# Altium schematic sheet PLD_RadFET_Watchdog.SchDoc: Watchdog for RadFET
size A4
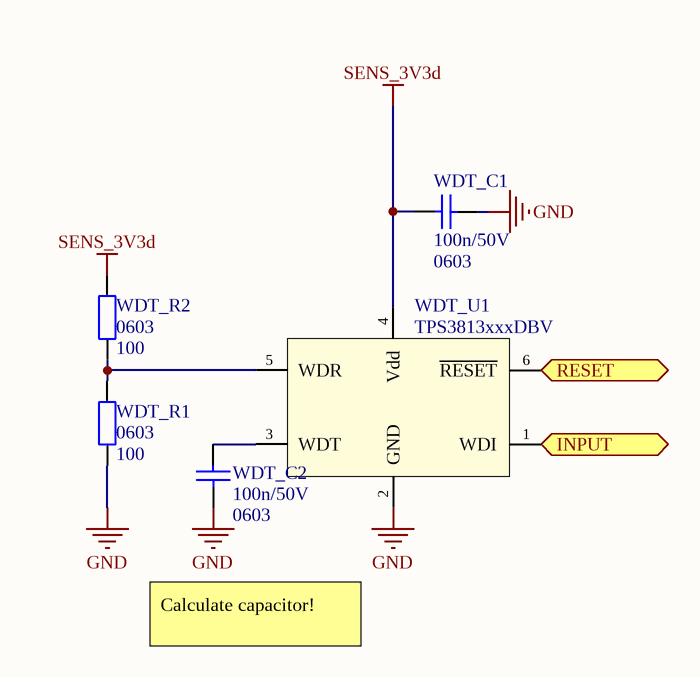
[diagram p0: PLD_RadFET_Watchdog.SchDoc]

## Parts
WDT_C1  Package: 0603  [SMD_Capacitor_0603]  (hidden comment: 100n/50V)
WDT_C2  Package: 0603  [SMD_Capacitor_0603]  (hidden comment: 100n/50V)
WDT_R1  0603  value 100  [SMD_Resistor_0603]
WDT_R2  0603  value 100  [SMD_Resistor_0603]
WDT_U1  TPS3813xxxDBV  [SOT23-6]

## Ports
INPUT (in), RESET (out)

## Nets
GND: WDT_C1.2 WDT_C2.2 WDT_R1.1 WDT_U1.2(GND)
SENS_3V3d: WDT_C1.1 WDT_R2.2 WDT_U1.4(Vdd)
INPUT: WDT_U1.1(WDI) ; port INPUT
RESET: WDT_U1.6(~{RESET}) ; port RESET
NetWDT_C2_1: WDT_C2.1 WDT_U1.3(WDT)
NetWDT_R1_2: WDT_R1.2 WDT_R2.1 WDT_U1.5(WDR)

## Notes on the sheet
- Calculate capacitor!
- Title:
- Project:
- Author:
- Model:
- Document Number:
- Checked by:
- Rev:
- Date:
- Approved by:
- Sheet:
- of
- File name:

## Library data of the parts
WDT_C1 WDT_C2 = Cer_C0603T104K5RALTU: Ceramic Cap Kemet COTS 100n/50V X7R 0603; Manufacturer: Kemet; ManufacturerPartNumber: C0603T104K5RALTU; Value: 100n/50V
WDT_R1 WDT_R2 = Res2: Resistor; Published: 8-Jun-2000; LatestRevisionDate: 17-Jul-2002; LatestRevisionNote: Re-released for DXP Platform.; PackageReference: AXIAL-0.4; Publisher: Altium Limited; PackageDescription: Axial Device, Thru-Hole; 2 Leads; 0.4 in Pin Spacing
WDT_U1 = TPS3813xxxDBV: Processor Supervisory Circuits with Window-Watchdog.; Manufacturer: Texas Instruments; Value: TPS3813xxxDBV